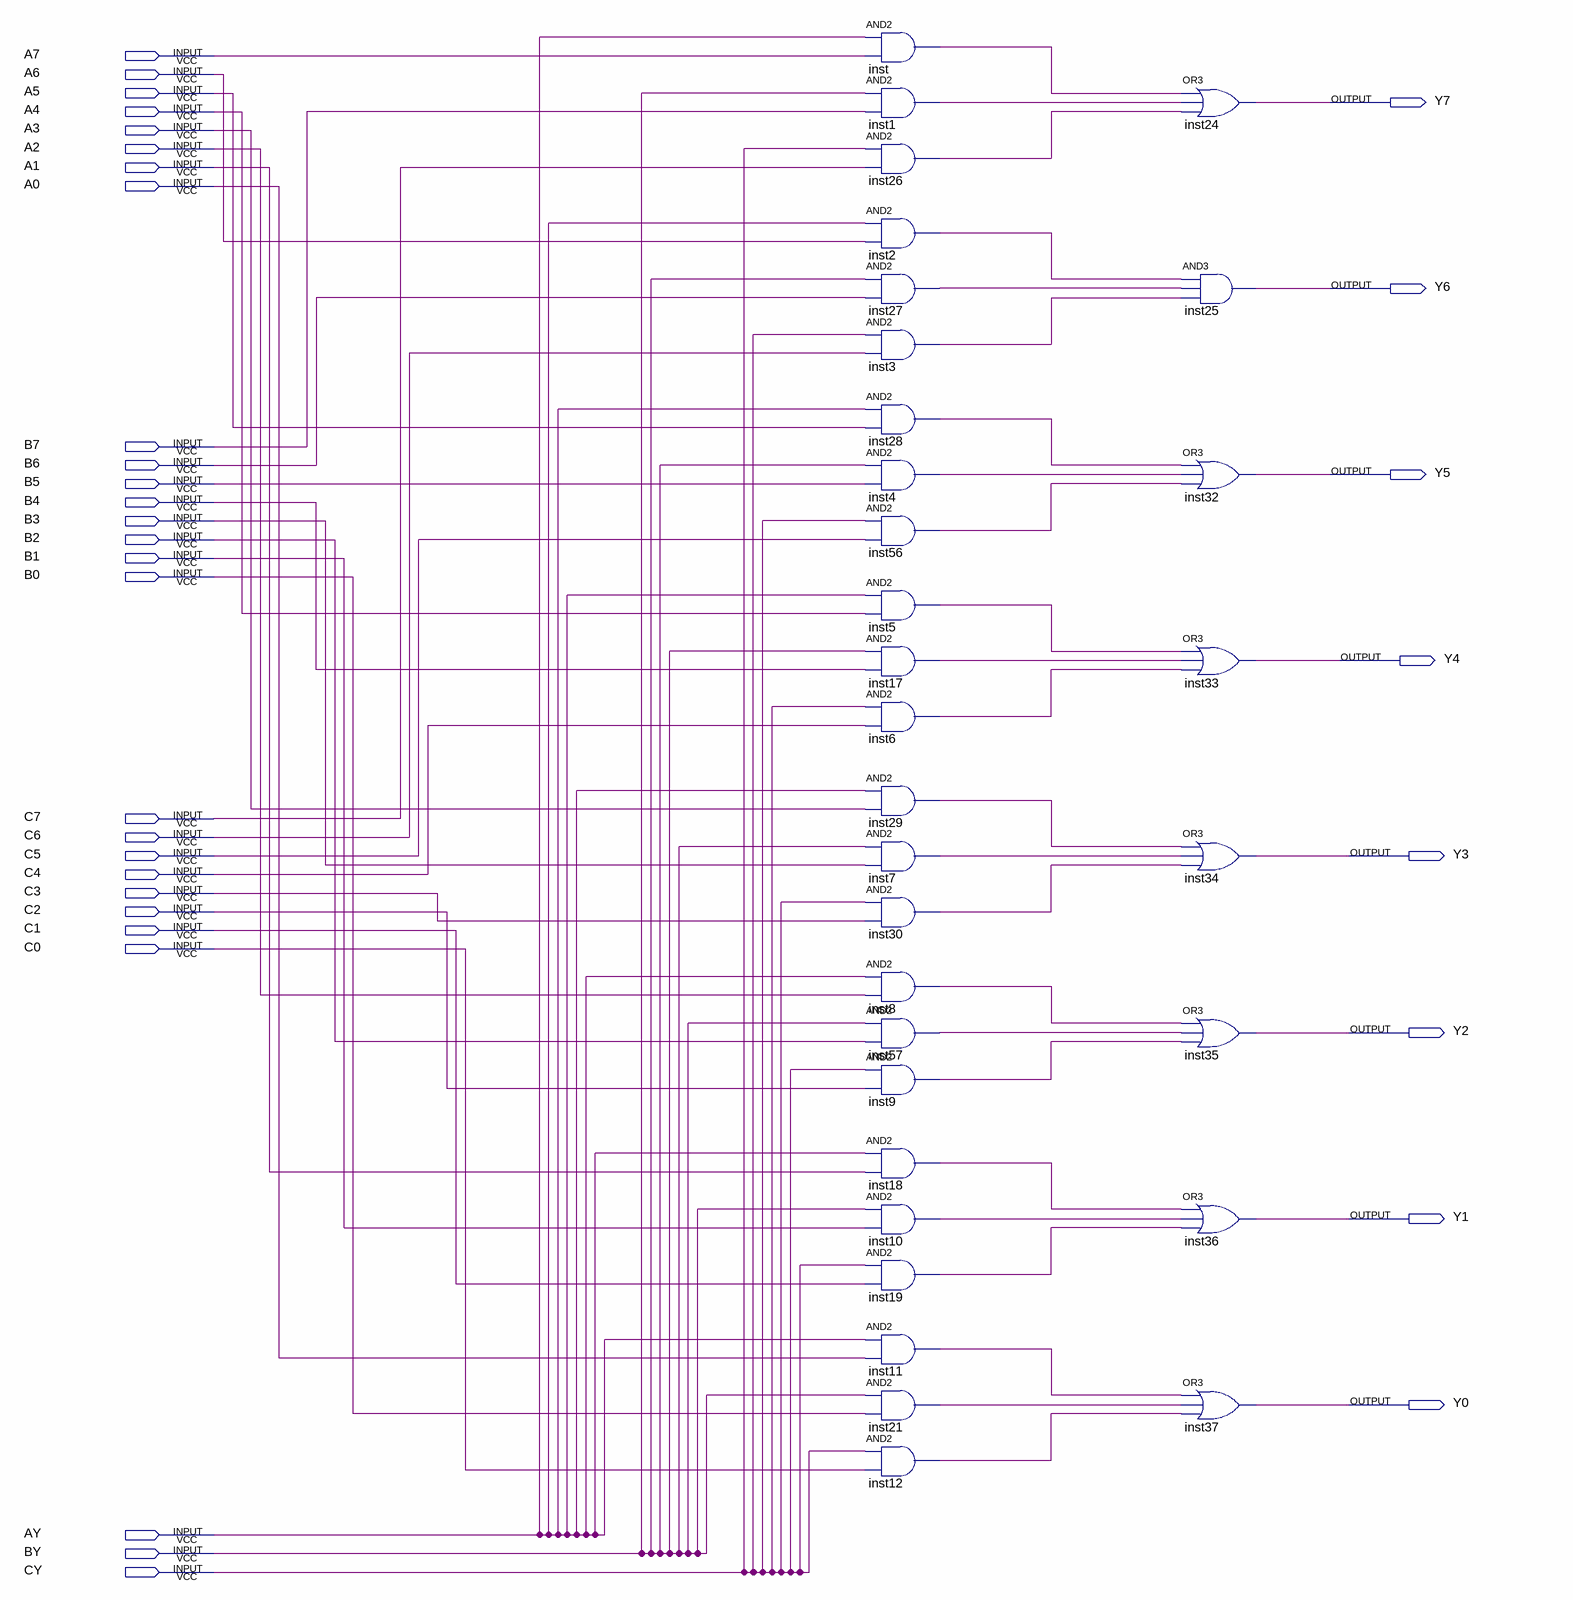
[diagram p0: schematic sheet]
// Quartus schematic multiplexer_3.bdf as structural Verilog: 32 symbols, 35 pins
module multiplexer_3 (
  input  A7,
  input  A6,
  input  A5,
  input  A4,
  input  A3,
  input  A2,
  input  A1,
  input  A0,
  input  B7,
  input  B6,
  input  B5,
  input  B4,
  input  B3,
  input  B2,
  input  B1,
  input  B0,
  input  C7,
  input  C6,
  input  C5,
  input  C4,
  input  C3,
  input  C2,
  input  C1,
  input  C0,
  input  AY,
  input  BY,
  input  CY,
  output Y7,
  output Y6,
  output Y5,
  output Y4,
  output Y3,
  output Y2,
  output Y1,
  output Y0
);

  wire inst1_out, inst2_out, inst3_out, inst4_out, inst5_out, inst6_out, inst7_out, inst8_out, inst9_out,
       inst10_out, inst11_out, inst12_out, inst17_out, inst18_out, inst19_out, inst21_out, inst26_out,
       inst27_out, inst28_out, inst29_out, inst30_out, inst56_out, inst57_out, inst_out;

  and inst (inst_out, AY, A7);
  and inst1 (inst1_out, BY, B7);
  and inst26 (inst26_out, CY, C7);
  and inst2 (inst2_out, AY, A6);
  and inst27 (inst27_out, BY, B6);
  and inst3 (inst3_out, CY, C6);
  and inst28 (inst28_out, AY, A5);
  and inst4 (inst4_out, BY, B5);
  and inst56 (inst56_out, CY, C5);
  and inst5 (inst5_out, AY, A4);
  and inst17 (inst17_out, BY, B4);
  and inst6 (inst6_out, CY, C4);
  and inst29 (inst29_out, AY, A3);
  and inst7 (inst7_out, BY, B3);
  and inst30 (inst30_out, CY, C3);
  and inst8 (inst8_out, AY, A2);
  and inst57 (inst57_out, BY, B2);
  and inst9 (inst9_out, CY, C2);
  and inst18 (inst18_out, AY, A1);
  and inst10 (inst10_out, BY, B1);
  and inst19 (inst19_out, CY, C1);
  and inst11 (inst11_out, AY, A0);
  and inst21 (inst21_out, BY, B0);
  and inst12 (inst12_out, CY, C0);
  or inst24 (Y7, inst_out, inst1_out, inst26_out);
  and inst25 (Y6, inst2_out, inst27_out, inst3_out);
  or inst32 (Y5, inst28_out, inst4_out, inst56_out);
  or inst33 (Y4, inst5_out, inst17_out, inst6_out);
  or inst34 (Y3, inst29_out, inst7_out, inst30_out);
  or inst35 (Y2, inst8_out, inst57_out, inst9_out);
  or inst36 (Y1, inst18_out, inst10_out, inst19_out);
  or inst37 (Y0, inst11_out, inst21_out, inst12_out);
endmodule
